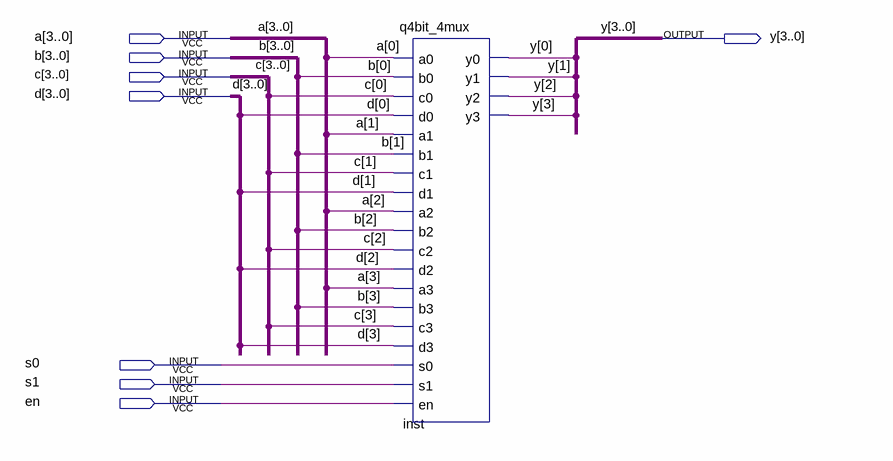
[diagram p0: schematic sheet]
// Quartus schematic t4bits_bus.bdf as structural Verilog: 1 symbols, 8 pins
module t4bits_bus (
  input  [3:0] a,
  input  [3:0] b,
  input  [3:0] c,
  input  [3:0] d,
  input  s0,
  input  s1,
  input  en,
  output [3:0] y
);

  q4bit_4mux inst (
    .a0(a[0]), .b0(b[0]), .c0(c[0]), .d0(d[0]), .a1(a[1]), .b1(b[1]), .c1(c[1]), .d1(d[1]), .a2(a[2]),
    .b2(b[2]), .c2(c[2]), .d2(d[2]), .a3(a[3]), .b3(b[3]), .c3(c[3]), .d3(d[3]), .s0(s0), .s1(s1), .en(en),
    .y0(y[0]), .y1(y[1]), .y2(y[2]), .y3(y[3]));
endmodule
